# Altium schematic sheet PWM_outputs.SchDoc
size A4
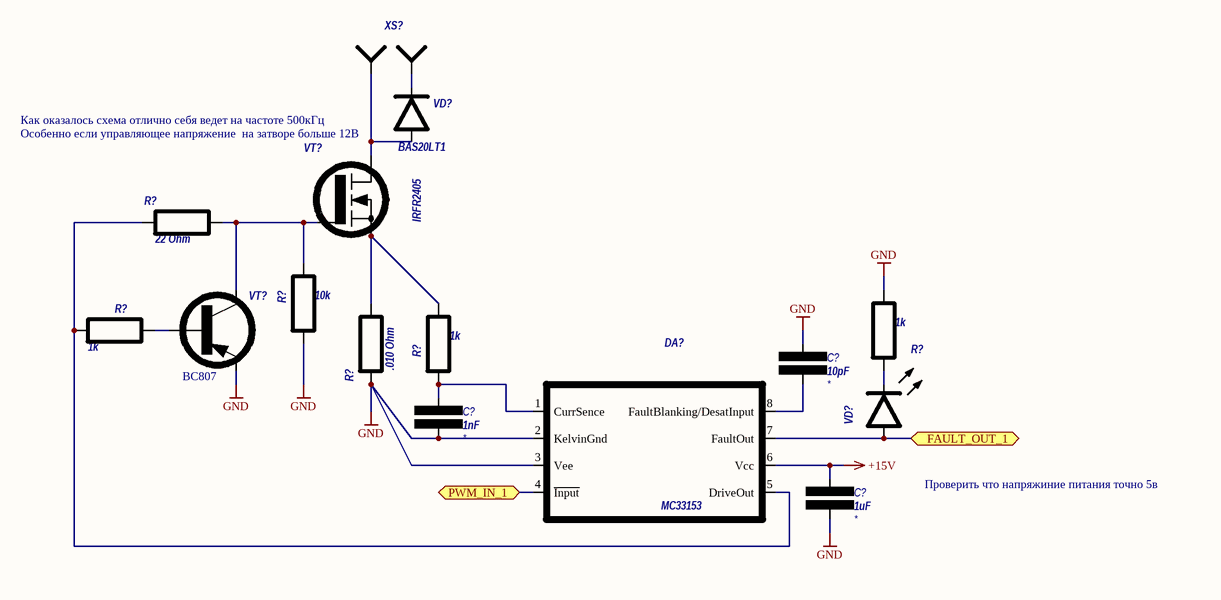
[diagram p0: PWM_outputs.SchDoc]

## Parts
(Parts that share a designator on the sheet are numbered #1, #2 ... from top to bottom, then left to right.)
C?#1  10pF  [C0805]
C?#2  1nF  [C0805]
C?#3  1uF  [C0805]
DA?  MC33153  [SOIC-8]
R?#1  22 Ohm  [R0805]
R?#2  1k  [R0603]
R?#3  1k  [R0603]
R?#4  10k  [R0603]
R?#5  1k  [R0603]
R?#6  .010 Ohm  [R2512]
VD?#1  BAS20LT1  [SOT23]
VD?#2  LED_0805  [led0805]  (value not drawn)
VT?#1  IRFR2405  [DPAK]
VT?#2  BC807  [SOT23]
XS?  2EDGV_2P  [2EDGV_2P]  (value not drawn)

## Ports
FAULT_OUT_1, PWM_IN_1

## Nets
+15V: C?#3.2 DA?.6(Vcc)
GND: C?#1.2 C?#2.1 C?#3.1 DA?.2(KelvinGnd) DA?.3(Vee) R?#4.1 R?#5.2 R?#6.1 VT?#2.2(emitter)
FAULT_OUT_1: DA?.7(FaultOut) VD?#2.2(A) ; port FAULT_OUT_1
PWM_IN_1: DA?.4(~{Input}) ; port PWM_IN_1
NetC?#1_1: C?#1.1 DA?.8(FaultBlanking/DesatInput)
NetC?#2_2: C?#2.2 DA?.1(CurrSence) R?#2.2
NetDA?_5: DA?.5(DriveOut) R?#1.1 R?#3.1
NetR?#1_2: R?#1.2 R?#4.2 VT?#1.1(gate) VT?#2.3(collector)
NetR?#2_1: R?#2.1 R?#6.2 VT?#1.2(source)
NetR?#3_2: R?#3.2 VT?#2.1(base)
NetR?#5_1: R?#5.1 VD?#2.1(K)
NetVD?#1_1: VD?#1.1(a) VT?#1.3(drain) XS?.1
NetVD?#1_3: VD?#1.3(k) XS?.2

## Notes on the sheet
- Как оказалось схема отлично себя ведет на частоте 500кГц
- Особенно если управляющее напряжение  на затворе больше 12В
- Проверить что напряжиние питания точно 5в

## Library data of the parts
C?#1-C?#3 = Capacitor: fab: *
  C?#1: Value: 10pF
  C?#2: Value: 1nF
  C?#3: Value: 1uF
DA? = MC33153: IGBT driver for high  power applications; Value: *
R?#1-R?#6 = Resistor_russian: Resistor
  R?#1: Value: 22 Ohm
  R?#2 R?#3 R?#5: Value: 1k
  R?#4: Value: 10k
  R?#6: Value: .010 Ohm
VD?#1 = BAS20LT1: High Voltage  Switching Diode; Value: {Value}
VD?#2 = LED_0805: Value: {Value}
VT?#1 = IRFR2405: Power n-channel MOSFET ,55V,56A,0.016Ohm; Value: IRFR2405
VT?#2 = BC807: Value: {Value}
XS? = 2EDGV_2P: Value: *